# EAGLE design array (EAGLE 6.6.0)
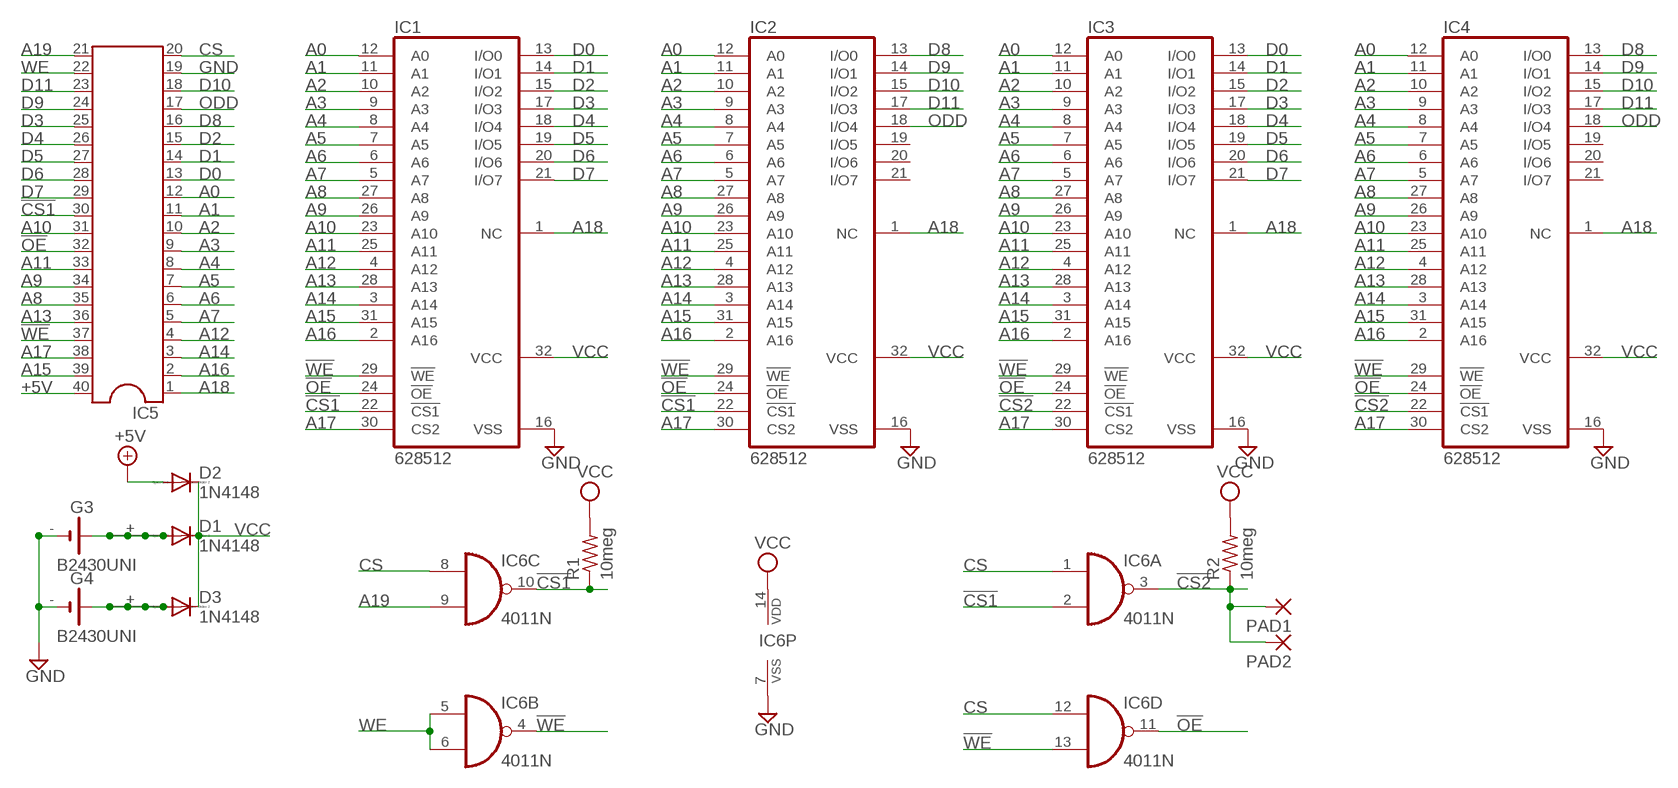
[diagram p0: schematic, sheet 1]

## Parts
D1  1N4148  1N4148DO35-10  [DO35-10]
D2  1N4148  1N4148DO35-10  [DO35-10]
D3  1N4148  1N4148DO35-10  [DO35-10]
G3  B2430UNI  [B2430UNI]
G4  B2430UNI  [B2430UNI]
IC1  628512  628128P  [DIL32]
IC2  628512  628128P  [DIL32]
IC3  628512  628128P  [DIL32]
IC4  628512  628128P  [DIL32]
IC5  DIL40  [DIL40]
IC6  4011N  [DIL14]
PAD1  1,6/0,8  [1,6/0,8]
PAD2  1,6/0,8  [1,6/0,8]
R1  10meg  R-US_0207/7  [0207/7]
R2  10meg  R-US_0207/7  [0207/7]

## Nets
!CS1: IC1.22(!CS1) IC2.22(!CS1) IC5.30 IC6.2(A:I1) IC6.10(C:O) R1.1
!CS2: IC3.22(!CS1) IC4.22(!CS1) IC6.3(A:O) PAD1.1(P) PAD2.1(P) R2.1
!OE: IC1.24(!OE) IC2.24(!OE) IC3.24(!OE) IC4.24(!OE) IC5.32 IC6.11(D:O)
!WE: IC1.29(!WE) IC2.29(!WE) IC3.29(!WE) IC4.29(!WE) IC5.37 IC6.4(B:O) IC6.13(D:I1)
+5V: D2.A IC5.40
A0: IC1.12(A0) IC2.12(A0) IC3.12(A0) IC4.12(A0) IC5.12
A1: IC1.11(A1) IC2.11(A1) IC3.11(A1) IC4.11(A1) IC5.11
A2: IC1.10(A2) IC2.10(A2) IC3.10(A2) IC4.10(A2) IC5.10
A3: IC1.9(A3) IC2.9(A3) IC3.9(A3) IC4.9(A3) IC5.9
A4: IC1.8(A4) IC2.8(A4) IC3.8(A4) IC4.8(A4) IC5.8
A5: IC1.7(A5) IC2.7(A5) IC3.7(A5) IC4.7(A5) IC5.7
A6: IC1.6(A6) IC2.6(A6) IC3.6(A6) IC4.6(A6) IC5.6
A7: IC1.5(A7) IC2.5(A7) IC3.5(A7) IC4.5(A7) IC5.5
A8: IC1.27(A8) IC2.27(A8) IC3.27(A8) IC4.27(A8) IC5.35
A9: IC1.26(A9) IC2.26(A9) IC3.26(A9) IC4.26(A9) IC5.34
A10: IC1.23(A10) IC2.23(A10) IC3.23(A10) IC4.23(A10) IC5.31
A11: IC1.25(A11) IC2.25(A11) IC3.25(A11) IC4.25(A11) IC5.33
A12: IC1.4(A12) IC2.4(A12) IC3.4(A12) IC4.4(A12) IC5.4
A13: IC1.28(A13) IC2.28(A13) IC3.28(A13) IC4.28(A13) IC5.36
A14: IC1.3(A14) IC2.3(A14) IC3.3(A14) IC4.3(A14) IC5.3
A15: IC1.31(A15) IC2.31(A15) IC3.31(A15) IC4.31(A15) IC5.39
A16: IC1.2(A16) IC2.2(A16) IC3.2(A16) IC4.2(A16) IC5.2
A17: IC1.30(CS2) IC2.30(CS2) IC3.30(CS2) IC4.30(CS2) IC5.38
A18: IC1.1(NC) IC2.1(NC) IC3.1(NC) IC4.1(NC) IC5.1
A19: IC5.21 IC6.9(C:I1)
CS: IC5.20 IC6.1(A:I0) IC6.8(C:I0) IC6.12(D:I0)
D0: IC1.13(I/O0) IC3.13(I/O0) IC5.13
D1: IC1.14(I/O1) IC3.14(I/O1) IC5.14
D2: IC1.15(I/O2) IC3.15(I/O2) IC5.15
D3: IC1.17(I/O3) IC3.17(I/O3) IC5.25
D4: IC1.18(I/O4) IC3.18(I/O4) IC5.26
D5: IC1.19(I/O5) IC3.19(I/O5) IC5.27
D6: IC1.20(I/O6) IC3.20(I/O6) IC5.28
D7: IC1.21(I/O7) IC3.21(I/O7) IC5.29
D8: IC2.13(I/O0) IC4.13(I/O0) IC5.16
D9: IC2.14(I/O1) IC4.14(I/O1) IC5.24
D10: IC2.15(I/O2) IC4.15(I/O2) IC5.18
D11: IC2.17(I/O3) IC4.17(I/O3) IC5.23
GND: G3.- G3.-@1(-) G4.- G4.-@1(-) IC1.16(VSS) IC2.16(VSS) IC3.16(VSS) IC4.16(VSS) IC5.19 IC6.7(P:VSS)
N$1: D1.A G3.+ G3.+@1(+) G3.+@2(+) G3.+@3(+) G3.+@4(+)
N$2: D3.A G4.+ G4.+@1(+) G4.+@2(+) G4.+@3(+) G4.+@4(+)
ODD: IC2.18(I/O4) IC4.18(I/O4) IC5.17
VCC: D1.C D2.C D3.C IC1.32(VCC) IC2.32(VCC) IC3.32(VCC) IC4.32(VCC) IC6.14(P:VDD) R1.2 R2.2
WE: IC5.22 IC6.5(B:I0) IC6.6(B:I1)
Unconnected: IC2.19(I/O5) IC2.20(I/O6) IC2.21(I/O7) IC4.19(I/O5) IC4.20(I/O6) IC4.21(I/O7)

## Library data of the parts
D1-D3 = diode:1N4148: DIODE high speed (Philips)
G3 G4 = battery:B2430UNI: LI BATTERY
IC1-IC4 = memory-hitachi:628128P: MEMORY; OC_FARNELL: unknown; OC_NEWARK: unknown
IC5 = ic-package:DIL40: Dual In Line
IC6 = 40xx:4011: Quad 2-input NAND
PAD1 PAD2 = wirepad:1,6/0,8: THROUGH-HOLE PAD
R1 R2 = rcl:R-US_: RESISTOR, American symbol

## Board
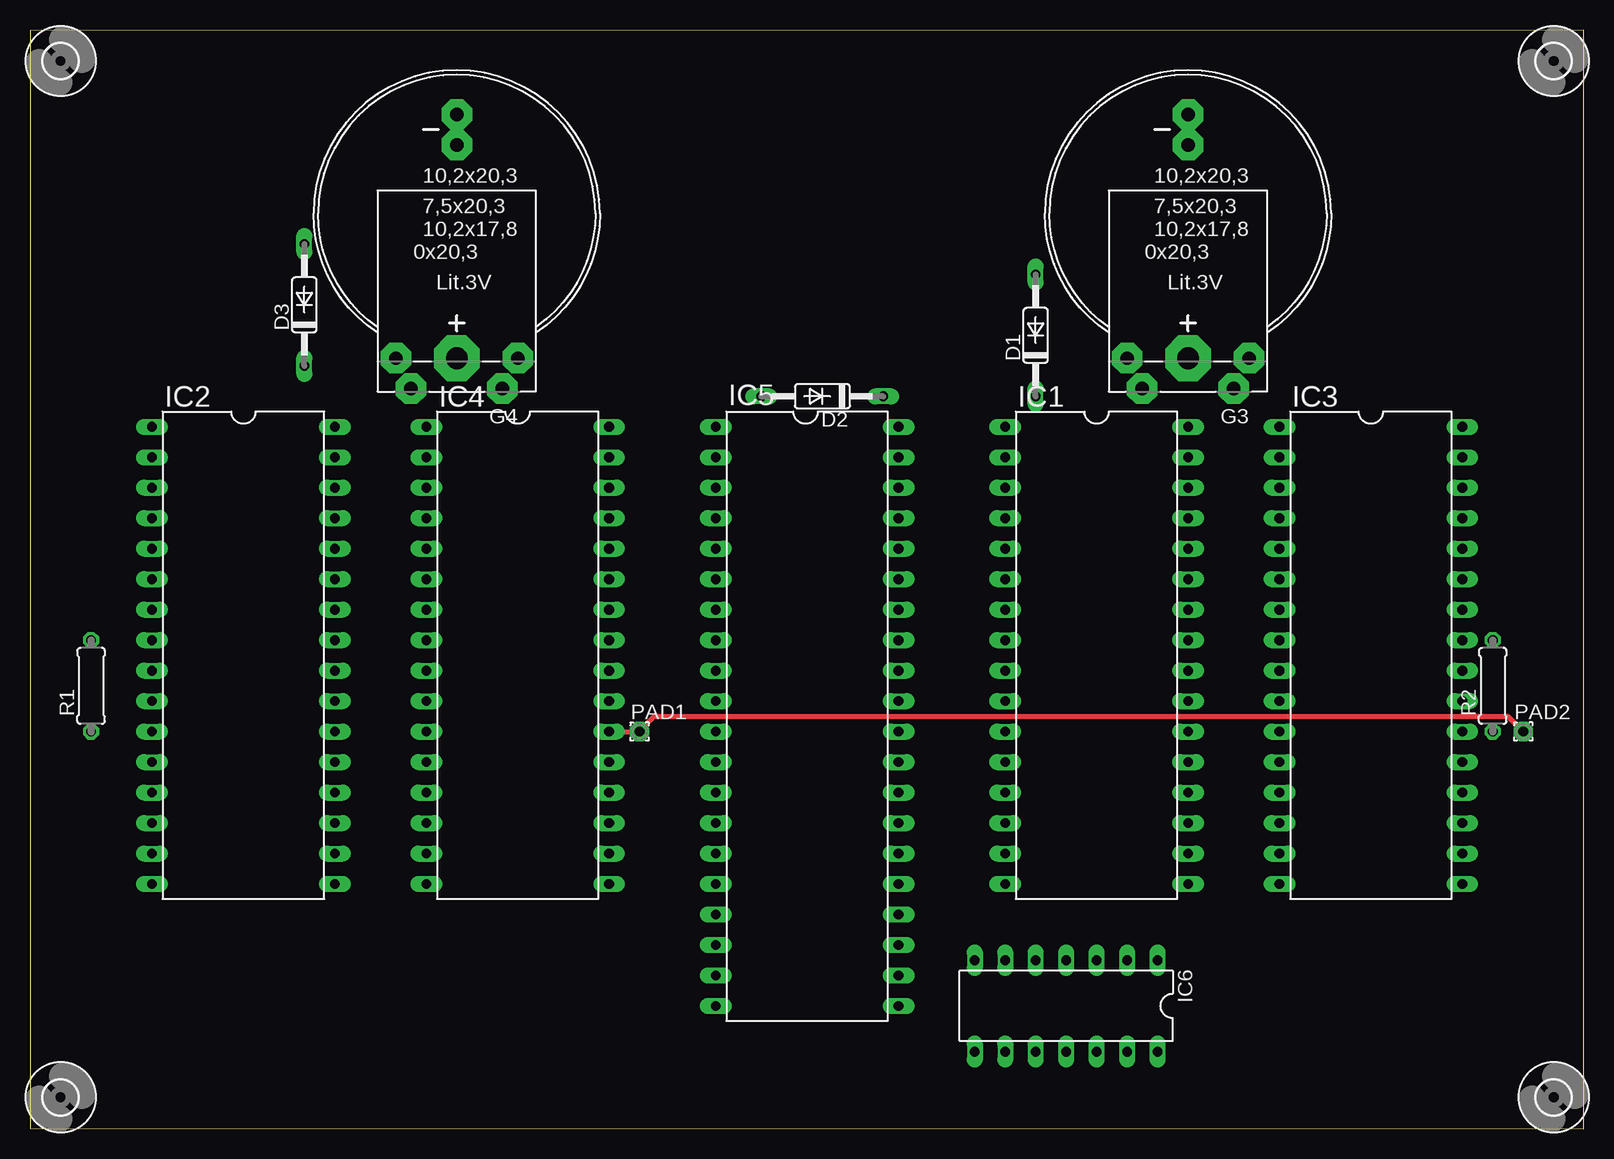
[diagram p1: board, top side]
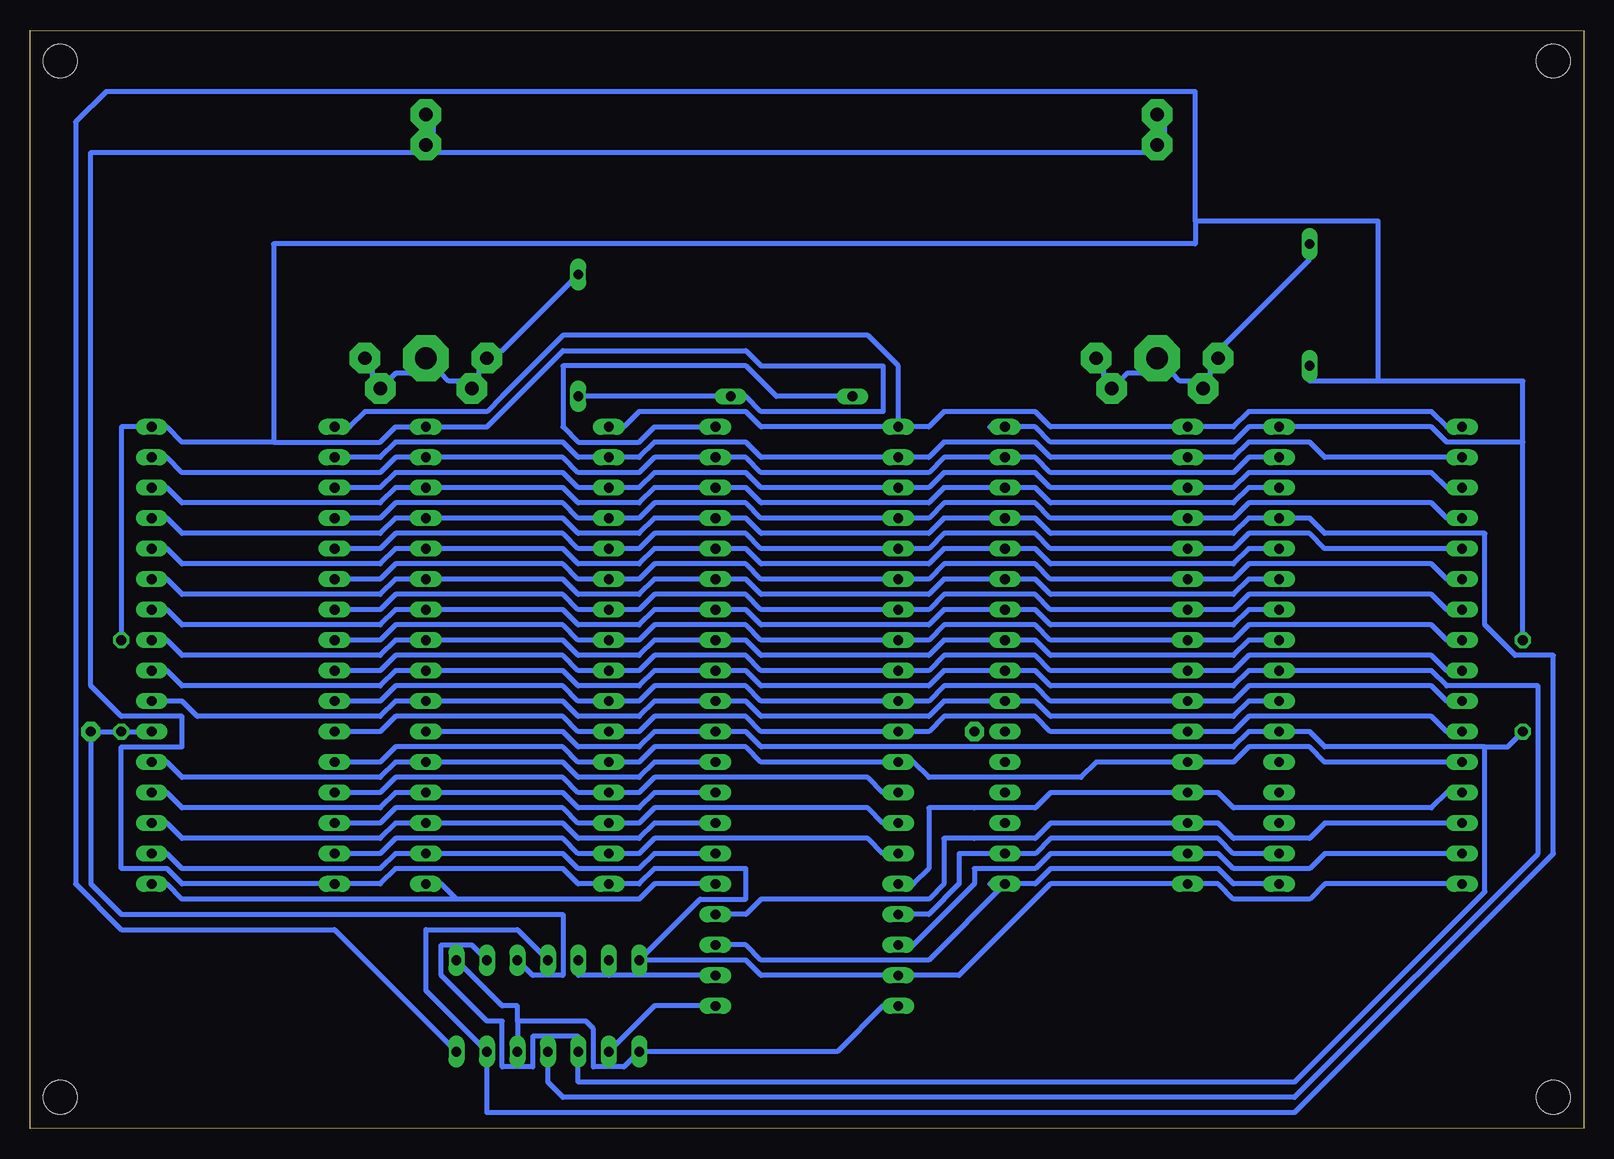
[diagram p2: board, bottom side, seen from below]

Size 129.54 x 91.56 mm. Coordinates in mm from the lower left corner, seen from the top.
Outline: 0,0.05 129.54,0 129.54,91.56 0.03,91.51 0,0.05
Copper layers (1+16): Top 0.035mm / dielectric 1.5mm / Bottom 0.035mm
Design rules "16mils": minimum track width 16mil, minimum drill 32mil, track to track 15mil, track to pad 10mil, pad to pad 10mil, via to via 10mil, smd to smd 10mil, copper to edge 13mil, drill to drill 10mil, minimum pad ring 10mil, minimum via ring 8mil, stop-mask expansion 0mil, vias tented up to drill 0mil, thermal gap 10mil

### Footprints (pad centres in the part's own frame; a part is rotated, then mirrored left to right if it is on the bottom)
DO35-10 = drill 0.813 long: A 5.08,0; C -5.08,0
B2430UNI = drill 1.118 pad 2.54 octagon: + 3.81,14.605; +@1 -3.81,14.605; +@2 -5.08,12.065; +@3 5.08,12.065; - 0,-5.715; -@1 0,-8.255 | drill 1.803 pad 3.81 octagon: +@4 0,12.065
DIL32 = drill 0.813 long: 1 -19.05,-7.62; 2 -16.51,-7.62; 3 -13.97,-7.62; 4 -11.43,-7.62; 5 -8.89,-7.62; 6 -6.35,-7.62; 7 -3.81,-7.62; 8 -1.27,-7.62; 9 1.27,-7.62; 10 3.81,-7.62; 11 6.35,-7.62; 12 8.89,-7.62; 13 11.43,-7.62; 14 13.97,-7.62; 15 16.51,-7.62; 16 19.05,-7.62; 17 19.05,7.62; 18 16.51,7.62; 19 13.97,7.62; 20 11.43,7.62; 21 8.89,7.62; 22 6.35,7.62; 23 3.81,7.62; 24 1.27,7.62; 25 -1.27,7.62; 26 -3.81,7.62; 27 -6.35,7.62; 28 -8.89,7.62; 29 -11.43,7.62; 30 -13.97,7.62; 31 -16.51,7.62; 32 -19.05,7.62
DIL40 = drill 0.813 long: 1 -24.13,-7.62; 2 -21.59,-7.62; 3 -19.05,-7.62; 4 -16.51,-7.62; 5 -13.97,-7.62; 6 -11.43,-7.62; 7 -8.89,-7.62; 8 -6.35,-7.62; 9 -3.81,-7.62; 10 -1.27,-7.62; 11 1.27,-7.62; 12 3.81,-7.62; 13 6.35,-7.62; 14 8.89,-7.62; 15 11.43,-7.62; 16 13.97,-7.62; 17 16.51,-7.62; 18 19.05,-7.62; 19 21.59,-7.62; 20 24.13,-7.62; 21 24.13,7.62; 22 21.59,7.62; 23 19.05,7.62; 24 16.51,7.62; 25 13.97,7.62; 26 11.43,7.62; 27 8.89,7.62; 28 6.35,7.62; 29 3.81,7.62; 30 1.27,7.62; 31 -1.27,7.62; 32 -3.81,7.62; 33 -6.35,7.62; 34 -8.89,7.62; 35 -11.43,7.62; 36 -13.97,7.62; 37 -16.51,7.62; 38 -19.05,7.62; 39 -21.59,7.62; 40 -24.13,7.62
DIL14 = drill 0.813 long: 1 -7.62,-3.81; 2 -5.08,-3.81; 3 -2.54,-3.81; 4 0,-3.81; 5 2.54,-3.81; 6 5.08,-3.81; 7 7.62,-3.81; 8 7.62,3.81; 9 5.08,3.81; 10 2.54,3.81; 11 0,3.81; 12 -2.54,3.81; 13 -5.08,3.81; 14 -7.62,3.81
1,6/0,8 = drill 0.813 pad 1.6 octagon: 1 0,0
0207/7 = drill 0.813 octagon: 1 -3.81,0; 2 3.81,0
2,8 = hole 2.8: 0,0

### Placement (x,y rotation side)
D1  83.83,66.11 90 top
D2  66.05,61.03 180 top
D3  22.87,68.65 90 top
G3  96.53,76.27 180 top
G4  35.57,76.27 180 top
IC1  88.91,39.44 270 top
IC2  17.79,39.44 270 top
IC3  111.77,39.44 270 top
IC4  40.65,39.44 270 top
IC5  64.78,34.36 270 top
IC6  86.37,10.23 180 top
PAD1  50.81,33.09 0 top
PAD2  124.47,33.09 0 top
R1  5.09,36.9 90 top
R2  121.93,36.9 90 top
U$1  [2,8]  2.55,88.97 0 top
U$2  [2,8]  127.01,88.97 0 top
U$3  [2,8]  127.01,2.61 0 top
U$4  [2,8]  2.55,2.61 0 top

### Tracks (layer width: path | path; a pad name or v marks a point on that pad's centre or on a via)
!CS1
  Bottom 0.406: IC6.2 92.72,15.31 95.26,15.31 95.26,12.77 91.45,8.96 90.18,8.96 90.18,5.15 87.64,5.15 87.64,7.69 83.83,7.69 IC6.10 83.83,3.88 24.14,3.88 8.27,19.76 8.27,31.82 | R1.1 6.36,31.82 8.27,31.82 | 8.27,31.82 21.6,31.82 22.87,33.09 IC2.22 27.95,33.09 29.22,31.82 68.59,31.82 69.86,33.09 IC5.30 77.48,33.09 78.75,31.82 83.83,31.82 85.1,33.09 IC1.22
!CS2
  Top 0.406: IC4.22 PAD1.1 52.08,34.36 123.2,34.36 PAD2.1
  Bottom 0.406: IC6.3 87.64,12.77 85.1,12.77 85.1,17.85 121.93,17.85 124.47,20.39 PAD2.1 R2.1 IC3.22
!OE
  Bottom 0.406: IC3.24 118.12,38.17 116.85,36.9 100.34,36.9 99.07,38.17 IC1.24 85.1,38.17 83.83,36.9 78.75,36.9 77.48,38.17 IC5.32 69.86,38.17 68.59,36.9 54.62,36.9 53.35,38.17 IC4.24 45.73,38.17 44.46,36.9 29.22,36.9 27.95,38.17 IC2.24 12.71,38.17 11.44,36.9 3.82,36.9 3.82,22.93 24.14,2.61 85.1,2.61 86.37,3.88 IC6.11
!WE
  Bottom 0.406: IC3.29 118.12,50.87 116.85,49.6 100.34,49.6 99.07,50.87 IC1.29 85.1,50.87 83.83,49.6 78.75,49.6 77.48,50.87 IC5.37 69.86,50.87 68.59,49.6 54.62,49.6 53.35,50.87 IC4.29 45.73,50.87 44.46,49.6 29.22,49.6 27.95,50.87 IC2.29 22.87,50.87 21.6,49.6 8.27,49.6 8.27,41.98 5.73,39.44 2.55,39.44 2.55,22.93 24.14,1.34 91.45,1.34 IC6.13 96.53,11.5 96.53,16.58 88.91,16.58 IC6.4
+5V
  Bottom 0.406: IC5.40 77.48,58.49 78.75,57.22 83.83,57.22 85.1,58.49 85.1,63.57 69.86,63.57 67.32,61.03 D2.A
A0
  Bottom 0.406: IC3.12 100.34,30.55 99.07,31.82 85.1,31.82 83.83,30.55 IC1.12 78.75,30.55 77.48,31.82 69.86,31.82 68.59,30.55 IC5.12 55.89,30.55 54.62,29.28 41.92,29.28 40.65,30.55 IC4.12 29.22,30.55 27.95,31.82 22.87,31.82 21.6,30.55 IC2.12
A1
  Bottom 0.406: IC2.11 11.44,33.09 12.71,34.36 27.95,34.36 29.22,33.09 IC4.11 44.46,33.09 45.73,34.36 53.35,34.36 54.62,33.09 IC5.11 68.59,33.09 69.86,34.36 77.48,34.36 78.75,33.09 IC1.11 83.83,33.09 85.1,34.36 99.07,34.36 100.34,33.09 IC3.11
A2
  Bottom 0.406: IC2.10 11.44,35.63 12.71,36.9 27.95,36.9 29.22,35.63 IC4.10 44.46,35.63 45.73,36.9 53.35,36.9 54.62,35.63 IC5.10 68.59,35.63 69.86,36.9 77.48,36.9 78.75,35.63 IC1.10 83.83,35.63 85.1,36.9 99.07,36.9 100.34,35.63 IC3.10
A3
  Bottom 0.406: IC2.9 11.44,38.17 12.71,39.44 27.95,39.44 29.22,38.17 IC4.9 44.46,38.17 45.73,39.44 53.35,39.44 54.62,38.17 IC5.9 68.59,38.17 69.86,39.44 77.48,39.44 78.75,38.17 IC1.9 83.83,38.17 85.1,39.44 99.07,39.44 100.34,38.17 IC3.9
A4
  Bottom 0.406: IC3.8 100.34,40.71 99.07,41.98 85.1,41.98 83.83,40.71 IC1.8 78.75,40.71 77.48,41.98 69.86,41.98 68.59,40.71 IC5.8 54.62,40.71 53.35,41.98 45.73,41.98 44.46,40.71 IC4.8 29.22,40.71 27.95,41.98 12.71,41.98 11.44,40.71 IC2.8
A5
  Bottom 0.406: IC2.7 11.44,43.25 12.71,44.52 27.95,44.52 29.22,43.25 IC4.7 44.46,43.25 45.73,44.52 53.35,44.52 54.62,43.25 IC5.7 68.59,43.25 69.86,44.52 77.48,44.52 78.75,43.25 IC1.7 83.83,43.25 85.1,44.52 99.07,44.52 100.34,43.25 IC3.7
A6
  Bottom 0.406: IC2.6 11.44,45.79 12.71,47.06 27.95,47.06 29.22,45.79 IC4.6 44.46,45.79 45.73,47.06 53.35,47.06 54.62,45.79 IC5.6 68.59,45.79 69.86,47.06 77.48,47.06 78.75,45.79 IC1.6 83.83,45.79 85.1,47.06 99.07,47.06 100.34,45.79 IC3.6
A7
  Bottom 0.406: IC3.5 100.34,48.33 99.07,49.6 85.1,49.6 83.83,48.33 IC1.5 78.75,48.33 77.48,49.6 69.86,49.6 68.59,48.33 IC5.5 54.62,48.33 53.35,49.6 45.73,49.6 44.46,48.33 IC4.5 29.22,48.33 27.95,49.6 22.87,49.6 21.6,48.33 IC2.5
A8
  Bottom 0.406: IC2.27 27.95,45.79 29.22,44.52 44.46,44.52 45.73,45.79 IC4.27 53.35,45.79 54.62,44.52 68.59,44.52 69.86,45.79 IC5.35 77.48,45.79 78.75,44.52 83.83,44.52 85.1,45.79 IC1.27 99.07,45.79 100.34,44.52 116.85,44.52 118.12,45.79 IC3.27
A9
  Bottom 0.406: IC3.26 118.12,43.25 116.85,41.98 100.34,41.98 99.07,43.25 IC1.26 85.1,43.25 83.83,41.98 78.75,41.98 77.48,43.25 IC5.34 69.86,43.25 68.59,41.98 54.62,41.98 53.35,43.25 IC4.26 45.73,43.25 44.46,41.98 29.22,41.98 27.95,43.25 IC2.26
A10
  Bottom 0.406: IC3.23 116.85,35.63 115.58,34.36 100.34,34.36 99.07,35.63 IC1.23 85.1,35.63 83.83,34.36 78.75,34.36 77.48,35.63 IC5.31 69.86,35.63 68.59,34.36 54.62,34.36 53.35,35.63 IC4.23 45.73,35.63 44.46,34.36 29.22,34.36 27.95,35.63 IC2.23
A11
  Bottom 0.406: IC3.25 118.12,40.71 116.85,39.44 100.34,39.44 99.07,40.71 IC1.25 85.1,40.71 83.83,39.44 78.75,39.44 77.48,40.71 IC5.33 69.86,40.71 68.59,39.44 54.62,39.44 53.35,40.71 IC4.25 45.73,40.71 44.46,39.44 29.22,39.44 27.95,40.71 IC2.25
A12
  Bottom 0.406: IC2.4 11.44,50.87 12.71,52.14 27.95,52.14 29.22,50.87 IC4.4 44.46,50.87 45.73,52.14 53.35,52.14 54.62,50.87 IC5.4 68.59,50.87 69.86,52.14 77.48,52.14 78.75,50.87 IC1.4 83.83,50.87 85.1,52.14 99.07,52.14 100.34,50.87 IC3.4
A13
  Bottom 0.406: IC3.28 118.12,48.33 116.85,47.06 100.34,47.06 99.07,48.33 IC1.28 85.1,48.33 83.83,47.06 78.75,47.06 77.48,48.33 IC5.36 69.86,48.33 68.59,47.06 54.62,47.06 53.35,48.33 IC4.28 45.73,48.33 44.46,47.06 29.22,47.06 27.95,48.33 IC2.28
A14
  Bottom 0.406: IC2.3 11.44,53.41 12.71,54.68 27.95,54.68 29.22,53.41 IC4.3 44.46,53.41 45.73,54.68 53.35,54.68 54.62,53.41 IC5.3 68.59,53.41 69.86,54.68 77.48,54.68 78.75,53.41 IC1.3 83.83,53.41 85.1,54.68 99.07,54.68 100.34,53.41 IC3.3
A15
  Bottom 0.406: IC3.31 118.12,55.95 116.85,54.68 100.34,54.68 99.07,55.95 IC1.31 85.1,55.95 83.83,54.68 78.75,54.68 77.48,55.95 IC5.39 69.86,55.95 68.59,54.68 54.62,54.68 53.35,55.95 IC4.31 45.73,55.95 44.46,54.68 29.22,54.68 27.95,55.95 IC2.31
A16
  Bottom 0.406: IC2.2 21.6,55.95 22.87,57.22 27.95,57.22 29.22,55.95 IC4.2 44.46,55.95 45.73,57.22 53.35,57.22 54.62,55.95 IC5.2 68.59,55.95 69.86,57.22 77.48,57.22 78.75,55.95 IC1.2 83.83,55.95 85.1,57.22 99.07,57.22 100.34,55.95 IC3.2
A17
  Bottom 0.406: IC3.30 118.12,53.41 116.85,52.14 100.34,52.14 99.07,53.41 IC1.30 85.1,53.41 83.83,52.14 78.75,52.14 77.48,53.41 IC5.38 69.86,53.41 68.59,52.14 54.62,52.14 53.35,53.41 IC4.30 45.73,53.41 44.46,52.14 29.22,52.14 27.95,53.41 IC2.30
A18
  Bottom 0.406: IC2.1 11.44,58.49 12.71,59.76 27.95,59.76 29.22,58.49 IC4.1 44.46,58.49 45.73,59.76 53.35,59.76 54.62,58.49 IC5.1 | IC5.1 68.59,58.49 69.86,59.76 78.75,59.76 80.02,58.49 IC1.1 | IC5.1 57.16,63.57 59.7,66.11 85.1,66.11 90.18,61.03 91.45,59.76 101.61,59.76 102.88,58.49 | 102.88,58.49 IC3.1 102.88,58.49
A19
  Bottom 0.406: IC6.9 77.48,10.23 IC5.21
CS
  Bottom 0.406: IC5.20 58.43,10.23 62.24,6.42 IC6.8 80.02,5.15 82.56,5.15 82.56,8.33 83.2,8.96 88.91,8.96 | 88.91,8.96 88.91,10.23 90.18,10.23 IC6.1 | 88.91,8.96 IC6.12
D0
  Bottom 0.406: IC5.13 58.43,28.01 59.7,29.28 77.48,29.28 78.75,28.01 IC1.13 83.83,28.01 85.1,29.28 99.07,29.28 100.34,28.01 IC3.13
D1
  Bottom 0.406: IC5.14 58.43,25.47 59.7,26.74 77.48,26.74 78.75,25.47 IC1.14 83.83,25.47 85.1,26.74 99.07,26.74 100.34,25.47 IC3.14
D2
  Bottom 0.406: IC5.15 58.43,22.93 59.7,24.2 77.48,24.2 78.75,22.93 IC1.15 83.83,22.93 85.1,24.2 99.07,24.2 100.34,22.93 IC3.15
D3
  Bottom 0.406: 93.99,19.12 78.75,19.12 77.48,20.39 IC5.25 | 93.99,19.12 95.26,20.39 IC1.17 | 93.99,19.12 116.85,19.12 118.12,20.39 IC3.17
D4
  Bottom 0.406: IC5.26 77.48,22.93 78.75,21.66 83.83,21.66 85.1,22.93 IC1.18 99.07,22.93 100.34,21.66 116.85,21.66 118.12,22.93 IC3.18
D5
  Bottom 0.406: IC5.27 77.48,25.47 78.75,24.2 83.83,24.2 85.1,25.47 IC1.19 99.07,25.47 100.34,24.2 116.85,24.2 118.12,25.47 IC3.19
D6
  Bottom 0.406: IC5.28 77.48,28.01 78.75,26.74 83.83,26.74 85.1,28.01 IC1.20 99.07,28.01 100.34,26.74 116.85,26.74 118.12,28.01 IC3.20
D7
  Bottom 0.406: IC5.29 77.48,30.55 78.75,29.28 83.83,29.28 85.1,30.55 IC1.21 99.07,30.55 100.34,29.28 116.85,29.28 118.12,30.55 IC3.21
D8
  Bottom 0.406: IC2.13 11.44,28.01 12.71,26.74 29.22,26.74 30.49,28.01 IC4.13 44.46,28.01 45.73,26.74 50.81,26.74 54.62,26.74 54.62,21.66 55.89,20.39 IC5.16
D9
  Bottom 0.406: IC2.14 21.6,25.47 22.87,24.2 29.22,24.2 30.49,25.47 IC4.14 44.46,25.47 45.73,24.2 50.81,24.2 53.35,24.2 53.35,20.39 54.62,19.12 68.59,19.12 69.86,17.85 IC5.24
D10
  Bottom 0.406: IC2.15 21.6,22.93 22.87,21.66 29.22,21.66 30.49,22.93 IC4.15 44.46,22.93 45.73,21.66 49.54,21.66 50.81,21.66 50.81,20.39 55.89,15.31 IC5.18
D11
  Bottom 0.406: IC5.23 69.86,15.31 68.59,14.04 54.62,14.04 IC4.17 | IC4.17 49.54,20.39 | IC2.17 26.68,20.39 29.22,20.39 30.49,21.66 44.46,21.66 45.73,20.39 IC4.17
GND
  Bottom 0.406: 95.9,81.35 96.53,81.35 124.47,81.35 124.47,36.9 121.93,34.36 116.85,34.36 116.85,31.82 121.93,31.82 121.93,21.66 118.12,21.66 116.85,20.39 IC3.16 100.34,20.39 99.07,21.66 85.1,21.66 83.83,20.39 IC1.16 78.75,20.39 77.48,21.66 69.86,21.66 69.86,19.12 73.67,19.12 IC6.7 69.86,14.04 68.59,12.77 IC5.19 52.08,12.77 44.46,20.39 IC4.16 30.49,20.39 29.22,19.12 22.87,19.12 21.6,20.39 IC2.16 | 95.9,81.35 35.57,81.35 G4.- 34.94,82.62 34.94,83.89 G4.-@1 | 95.9,81.35 G3.- 95.9,82.62 95.9,83.89 G3.-@1
N$1
  Bottom 0.406: G3.+@2 100.98,63.57 100.98,62.3 G3.+@1 99.71,62.3 99.07,62.94 97.8,62.94 G3.+@4 95.26,62.94 94.63,62.3 93.36,62.3 G3.+ 92.09,62.3 92.09,63.57 G3.+@3 90.82,64.84 90.18,64.84 84.47,70.56 D1.A
N$2
  Bottom 0.406: G4.+@2 40.02,63.57 40.02,62.3 G4.+@1 38.75,62.3 38.11,62.94 36.84,62.94 G4.+@4 34.3,62.94 33.67,62.3 32.4,62.3 G4.+ 31.13,62.3 31.13,63.57 G4.+@3 30.49,64.84 22.87,72.46 D3.A
ODD
  Bottom 0.406: IC2.18 29.22,22.93 30.49,24.2 44.46,24.2 45.73,22.93 IC4.18 52.08,22.93 52.08,20.39 54.62,17.85 IC5.17
VCC
  Bottom 0.406: 5.09,57.22 5.09,62.3 17.16,62.3 | R1.2 5.09,57.22 | 17.16,62.3 22.87,62.3 D3.C | 5.09,57.22 11.44,57.22 12.71,58.49 IC2.32 27.95,58.49 29.22,57.22 44.46,57.22 45.73,58.49 49.54,58.49 IC4.32 47,58.49 | D1.C D2.C 69.86,61.03 68.59,59.76 58.43,59.76 58.43,63.57 68.59,63.57 69.86,64.84 85.1,64.84 91.45,58.49 IC1.32 99.07,58.49 100.34,57.22 109.23,57.22 | 109.23,57.22 116.85,57.22 118.12,58.49 IC3.32 121.93,58.49 R2.2 | 109.23,57.22 109.23,73.73 32.4,73.73 32.4,75.64 | IC6.14 104.15,16.58 121.93,16.58 125.74,20.39 125.74,83.89 123.2,86.43 32.4,86.43 32.4,75.64 | 17.16,62.3 17.16,75.64 32.4,75.64
WE
  Bottom 0.406: 81.29,12.77 83.83,12.77 IC6.5 | IC5.22 81.29,12.77 | 81.29,12.77 IC6.6